# Altium schematic sheet A7_MGT - Ⅱ.SchDoc
size A3
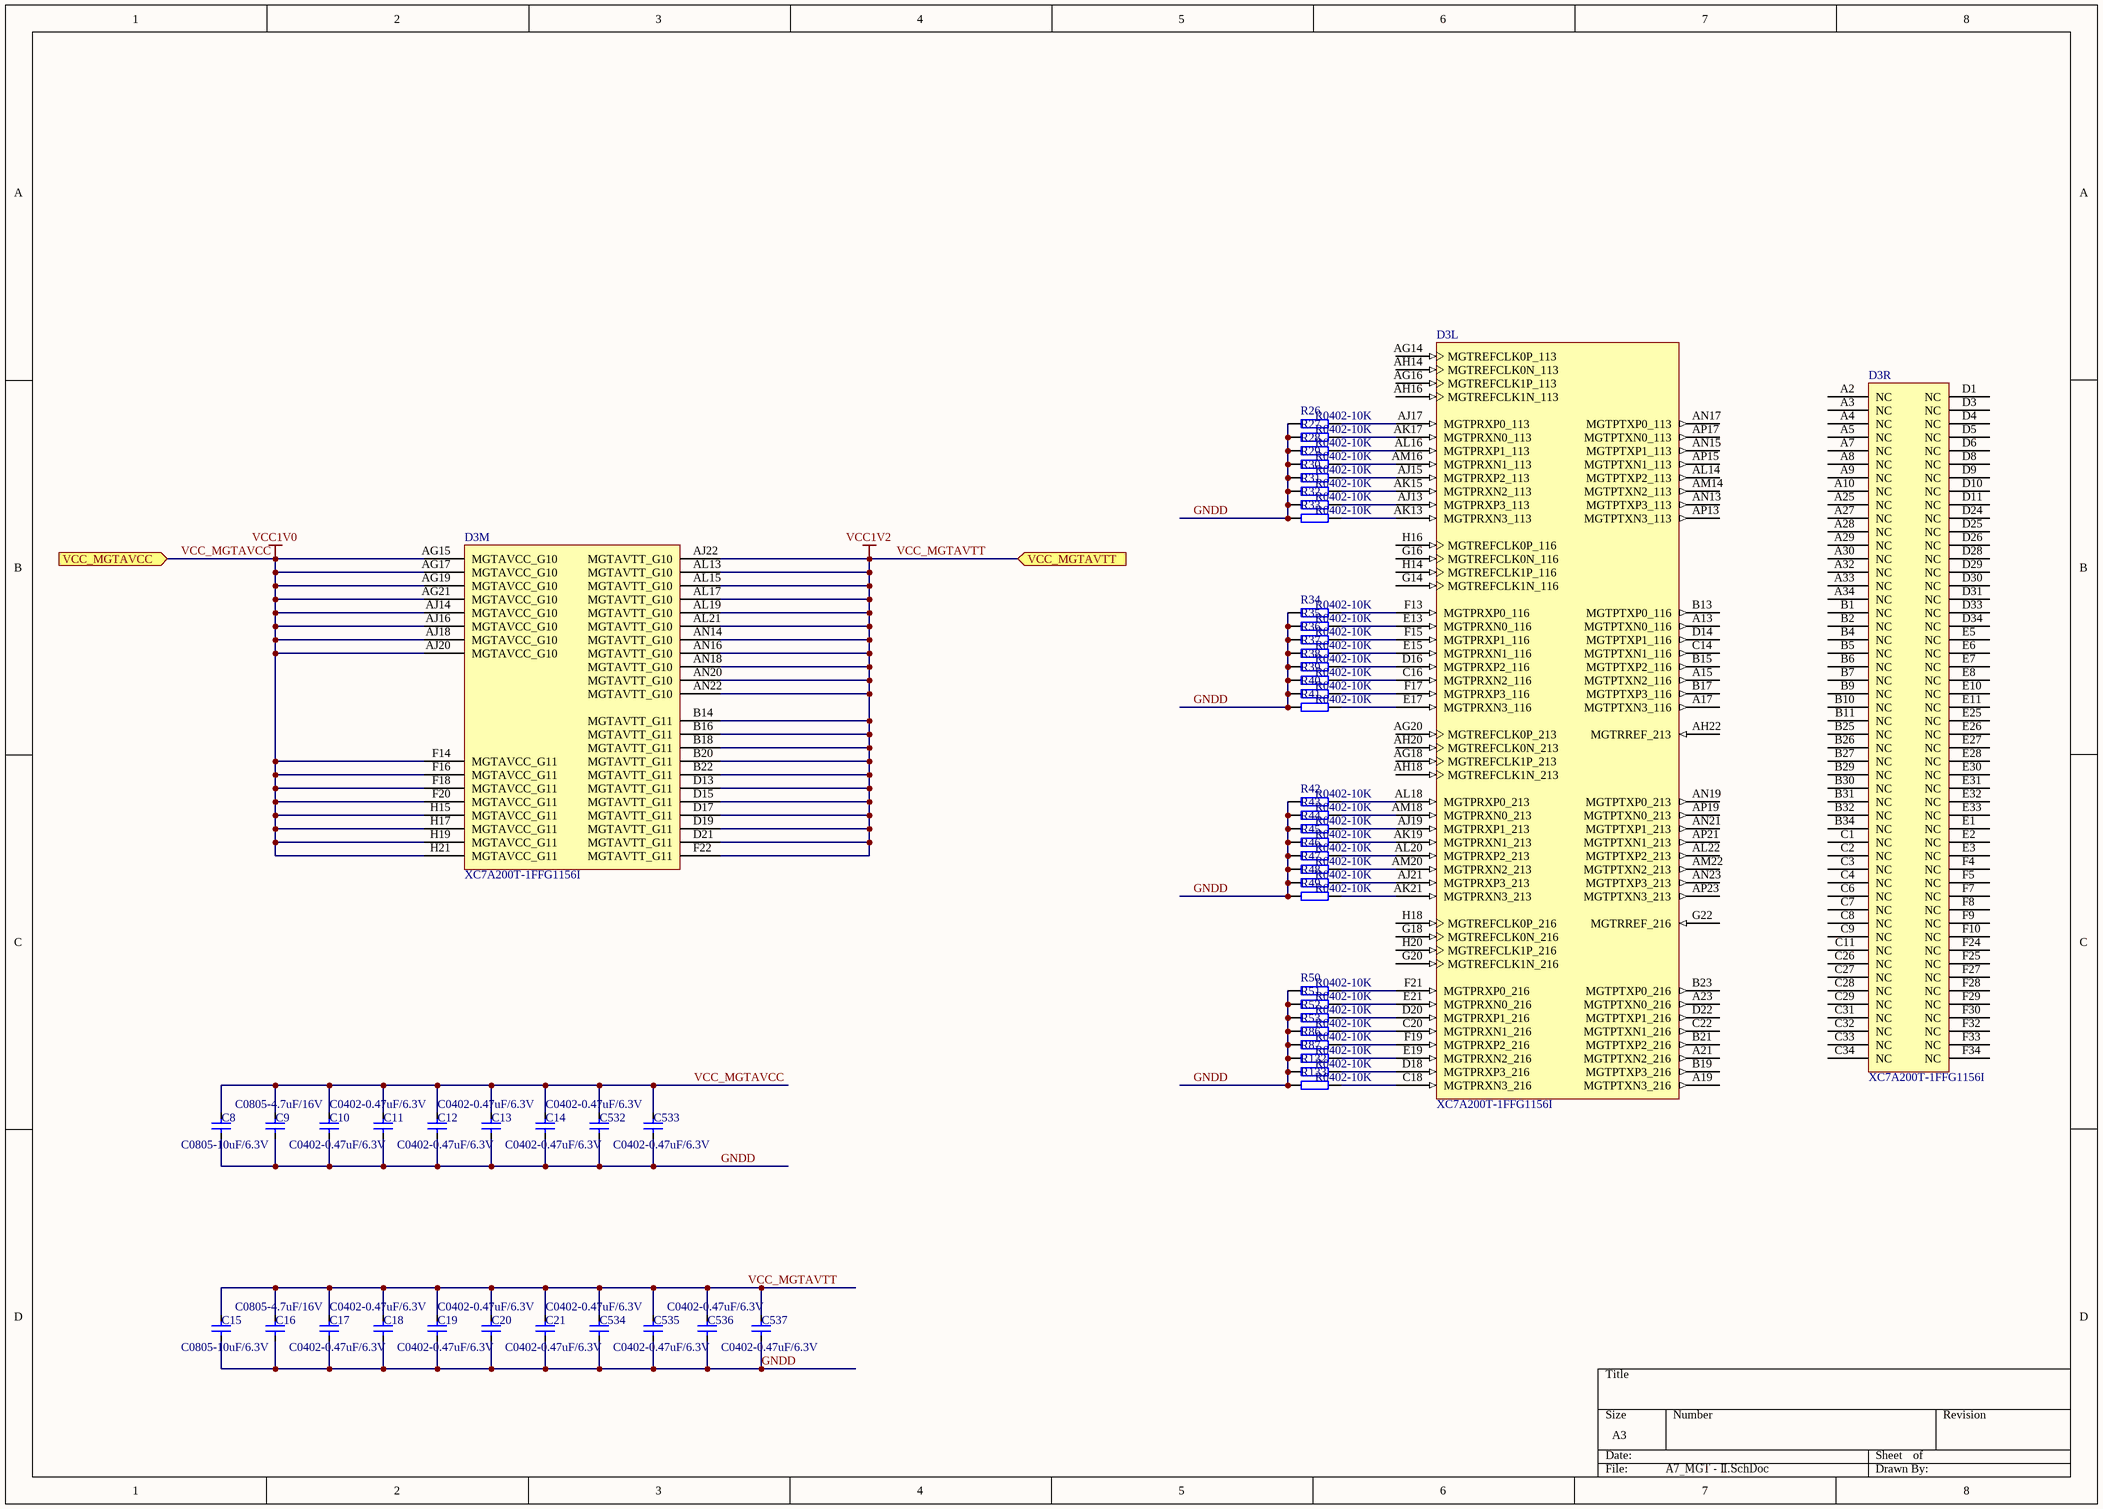
[diagram p0: A7_MGT - Ⅱ.SchDoc]

## Parts
C8  C0805-10uF/6.3V  [C0805]
C9  C0805-4.7uF/16V  [C0805]
C10  C0402-0.47uF/6.3V  [C0402]
C11  C0402-0.47uF/6.3V  [C0402]
C12  C0402-0.47uF/6.3V  [C0402]
C13  C0402-0.47uF/6.3V  [C0402]
C14  C0402-0.47uF/6.3V  [C0402]
C15  C0805-10uF/6.3V  [C0805]
C16  C0805-4.7uF/16V  [C0805]
C17  C0402-0.47uF/6.3V  [C0402]
C18  C0402-0.47uF/6.3V  [C0402]
C19  C0402-0.47uF/6.3V  [C0402]
C20  C0402-0.47uF/6.3V  [C0402]
C21  C0402-0.47uF/6.3V  [C0402]
C532  C0402-0.47uF/6.3V  [C0402]
C533  C0402-0.47uF/6.3V  [C0402]
C534  C0402-0.47uF/6.3V  [C0402]
C535  C0402-0.47uF/6.3V  [C0402]
C536  C0402-0.47uF/6.3V  [C0402]
C537  C0402-0.47uF/6.3V  [C0402]
D3  XC7A200T-1FFG1156I  [FFG1156]  (parts L,M,R of 18)
R26  R0402-10K  [R0402]
R27  R0402-10K  [R0402]
R28  R0402-10K  [R0402]
R29  R0402-10K  [R0402]
R30  R0402-10K  [R0402]
R31  R0402-10K  [R0402]
R32  R0402-10K  [R0402]
R33  R0402-10K  [R0402]
R34  R0402-10K  [R0402]
R35  R0402-10K  [R0402]
R36  R0402-10K  [R0402]
R37  R0402-10K  [R0402]
R38  R0402-10K  [R0402]
R39  R0402-10K  [R0402]
R40  R0402-10K  [R0402]
R41  R0402-10K  [R0402]
R42  R0402-10K  [R0402]
R43  R0402-10K  [R0402]
R44  R0402-10K  [R0402]
R45  R0402-10K  [R0402]
R46  R0402-10K  [R0402]
R47  R0402-10K  [R0402]
R48  R0402-10K  [R0402]
R49  R0402-10K  [R0402]
R50  R0402-10K  [R0402]
R51  R0402-10K  [R0402]
R52  R0402-10K  [R0402]
R53  R0402-10K  [R0402]
R86  R0402-10K  [R0402]
R87  R0402-10K  [R0402]
R132  R0402-10K  [R0402]
R133  R0402-10K  [R0402]

## Ports
VCC_MGTAVCC (in), VCC_MGTAVTT (in)

## Nets
VCC_MGTAVCC: C8.1 C9.1 C10.1 C11.1 C12.1 C13.1 C14.1 C532.1 C533.1 D3.AG15(MGTAVCC_G10) D3.AG17(MGTAVCC_G10) D3.AG19(MGTAVCC_G10) D3.AG21(MGTAVCC_G10) D3.AJ14(MGTAVCC_G10) D3.AJ16(MGTAVCC_G10) D3.AJ18(MGTAVCC_G10) D3.AJ20(MGTAVCC_G10) D3.F14(MGTAVCC_G11) D3.F16(MGTAVCC_G11) D3.F18(MGTAVCC_G11) D3.F20(MGTAVCC_G11) D3.H15(MGTAVCC_G11) D3.H17(MGTAVCC_G11) D3.H19(MGTAVCC_G11) D3.H21(MGTAVCC_G11) ; port VCC_MGTAVCC  [also labelled VCC1V0]
VCC_MGTAVTT: C15.1 C16.1 C17.1 C18.1 C19.1 C20.1 C21.1 C534.1 C535.1 C536.1 C537.1 D3.AJ22(MGTAVTT_G10) D3.AL13(MGTAVTT_G10) D3.AL15(MGTAVTT_G10) D3.AL17(MGTAVTT_G10) D3.AL19(MGTAVTT_G10) D3.AL21(MGTAVTT_G10) D3.AN14(MGTAVTT_G10) D3.AN16(MGTAVTT_G10) D3.AN18(MGTAVTT_G10) D3.AN20(MGTAVTT_G10) D3.AN22(MGTAVTT_G10) D3.B14(MGTAVTT_G11) D3.B16(MGTAVTT_G11) D3.B18(MGTAVTT_G11) D3.B20(MGTAVTT_G11) D3.B22(MGTAVTT_G11) D3.D13(MGTAVTT_G11) D3.D15(MGTAVTT_G11) D3.D17(MGTAVTT_G11) D3.D19(MGTAVTT_G11) D3.D21(MGTAVTT_G11) D3.F22(MGTAVTT_G11) ; port VCC_MGTAVTT  [also labelled VCC1V2]
GNDD: C8.2 C9.2 C10.2 C11.2 C12.2 C13.2 C14.2 C15.2 C16.2 C17.2 C18.2 C19.2 C20.2 C21.2 C532.2 C533.2 C534.2 C535.2 C536.2 C537.2 R26.1 R27.1 R28.1 R29.1 R30.1 R31.1 R32.1 R33.1 R34.1 R35.1 R36.1 R37.1 R38.1 R39.1 R40.1 R41.1 R42.1 R43.1 R44.1 R45.1 R46.1 R47.1 R48.1 R49.1 R50.1 R51.1 R52.1 R53.1 R86.1 R87.1 R132.1 R133.1
NetD3_AJ13: D3.AJ13(MGTPRXP3_113) R32.2
NetD3_AJ15: D3.AJ15(MGTPRXP2_113) R30.2
NetD3_AJ17: D3.AJ17(MGTPRXP0_113) R26.2
NetD3_AJ19: D3.AJ19(MGTPRXP1_213) R44.2
NetD3_AJ21: D3.AJ21(MGTPRXP3_213) R48.2
NetD3_AK13: D3.AK13(MGTPRXN3_113) R33.2
NetD3_AK15: D3.AK15(MGTPRXN2_113) R31.2
NetD3_AK17: D3.AK17(MGTPRXN0_113) R27.2
NetD3_AK19: D3.AK19(MGTPRXN1_213) R45.2
NetD3_AK21: D3.AK21(MGTPRXN3_213) R49.2
NetD3_AL16: D3.AL16(MGTPRXP1_113) R28.2
NetD3_AL18: D3.AL18(MGTPRXP0_213) R42.2
NetD3_AL20: D3.AL20(MGTPRXP2_213) R46.2
NetD3_AM16: D3.AM16(MGTPRXN1_113) R29.2
NetD3_AM18: D3.AM18(MGTPRXN0_213) R43.2
NetD3_AM20: D3.AM20(MGTPRXN2_213) R47.2
NetD3_C16: D3.C16(MGTPRXN2_116) R39.2
NetD3_C18: D3.C18(MGTPRXN3_216) R133.2
NetD3_C20: D3.C20(MGTPRXN1_216) R53.2
NetD3_D16: D3.D16(MGTPRXP2_116) R38.2
NetD3_D18: D3.D18(MGTPRXP3_216) R132.2
NetD3_D20: D3.D20(MGTPRXP1_216) R52.2
NetD3_E13: D3.E13(MGTPRXN0_116) R35.2
NetD3_E15: D3.E15(MGTPRXN1_116) R37.2
NetD3_E17: D3.E17(MGTPRXN3_116) R41.2
NetD3_E19: D3.E19(MGTPRXN2_216) R87.2
NetD3_E21: D3.E21(MGTPRXN0_216) R51.2
NetD3_F13: D3.F13(MGTPRXP0_116) R34.2
NetD3_F15: D3.F15(MGTPRXP1_116) R36.2
NetD3_F17: D3.F17(MGTPRXP3_116) R40.2
NetD3_F19: D3.F19(MGTPRXP2_216) R86.2
NetD3_F21: D3.F21(MGTPRXP0_216) R50.2

Not connected (* = marked no-connect by the designer): D3 A2(NC) A3(NC) A4(NC) A5(NC) A7(NC) A8(NC) A9(NC) A10(NC) A13(MGTPTXN0_116) A15(MGTPTXN2_116) A17(MGTPTXN3_116) A19(MGTPTXN3_216) A21(MGTPTXN2_216) A23(MGTPTXN0_216) A25(NC) A27(NC) A28(NC) A29(NC) A30(NC) A32(NC) A33(NC) A34(NC) AG14(MGTREFCLK0P_113) AG16(MGTREFCLK1P_113) AG18(MGTREFCLK1P_213) AG20(MGTREFCLK0P_213) AH14(MGTREFCLK0N_113) AH16(MGTREFCLK1N_113) AH18(MGTREFCLK1N_213) AH20(MGTREFCLK0N_213) AH22(MGTRREF_213) AL14(MGTPTXP2_113) AL22(MGTPTXP2_213) AM14(MGTPTXN2_113) AM22(MGTPTXN2_213) AN13(MGTPTXP3_113) AN15(MGTPTXP1_113) AN17(MGTPTXP0_113) AN19(MGTPTXP0_213) AN21(MGTPTXP1_213) AN23(MGTPTXP3_213) AP13(MGTPTXN3_113) AP15(MGTPTXN1_113) AP17(MGTPTXN0_113) AP19(MGTPTXN0_213) AP21(MGTPTXN1_213) AP23(MGTPTXN3_213) B1(NC) B2(NC) B4(NC) B5(NC) B6(NC) B7(NC) B9(NC) B10(NC) B11(NC) B13(MGTPTXP0_116) B15(MGTPTXP2_116) B17(MGTPTXP3_116) B19(MGTPTXP3_216) B21(MGTPTXP2_216) B23(MGTPTXP0_216) B25(NC) B26(NC) B27(NC) B29(NC) B30(NC) B31(NC) B32(NC) B34(NC) C1(NC) C2(NC) C3(NC) C4(NC) C6(NC) C7(NC) C8(NC) C9(NC) C11(NC) C14(MGTPTXN1_116) C22(MGTPTXN1_216) C26(NC) C27(NC) C28(NC) C29(NC) C31(NC) C32(NC) C33(NC) C34(NC) D1(NC) D3(NC) D4(NC) D5(NC) D6(NC) D8(NC) D9(NC) D10(NC) D11(NC) D14(MGTPTXP1_116) D22(MGTPTXP1_216) D24(NC) D25(NC) D26(NC) D28(NC) D29(NC) D30(NC) D31(NC) D33(NC) D34(NC) E1(NC) E2(NC) E3(NC) E5(NC) E6(NC) E7(NC) E8(NC) E10(NC) E11(NC) E25(NC) E26(NC) E27(NC) E28(NC) E30(NC) E31(NC) E32(NC) E33(NC) F4(NC) F5(NC) F7(NC) F8(NC) F9(NC) F10(NC) F24(NC) F25(NC) F27(NC) F28(NC) F29(NC) F30(NC) F32(NC) F33(NC) F34(NC) G14(MGTREFCLK1N_116) G16(MGTREFCLK0N_116) G18(MGTREFCLK0N_216) G20(MGTREFCLK1N_216) G22(MGTRREF_216) H14(MGTREFCLK1P_116) H16(MGTREFCLK0P_116) H18(MGTREFCLK0P_216) H20(MGTREFCLK1P_216)

## Library data of the parts
C8 C15 = C1210-22uF/16V: Part_number: C0805-10uF/6.3V; Part_type: CAP; Value: C0805-10uF/6.3V; Schematic_Part: CAP; PCB_Footprint: C0805
C9 C16 = C0805-4.7uF/50V: X7R; Manufacturer: SAMSUNG; Part_number: C0805-4.7uF/16V; Part_type: CAP; Value: C0805-4.7uF/16V; Schematic_Part: CAP; PCB_Footprint: C0805; datasheet: #DataSheet\C_Samsung_General Capacitors.pdf#
C10-C14 C17-C21 C532-C537 = C0402-0.1uF/16V: X7R; Manufacturer: SAMSUNG; Manufacturer_p/n: CL05X7R104KO5NNN; Part_number: C0402-0.47uF/6.3V; Part_type: CAP; Value: C0402-0.47uF/6.3V; temperature: -55℃\+125℃; Schematic_Part: CAP; PCB_Footprint: C0402; datasheet: #DataSheet\C_Samsung_General Capacitors.pdf#
D3 = XC7A200T-1FFG1156I: Artix-7 FPGA, 500 User I/Os, 16 GTP, 1156-Ball BGA, Speed Grade 1, Industrial Grade, Pb-Free; Manufacturer: Xilinx; Block RAM Blocks (18Kb): 730; Block RAM Blocks (36Kb): 365; Block RAM Blocks (Max Kb): 13140; CLBs (Slices): 33650; Clock Mgmt Tiles (CMTs): 10; DSP48E1 Slices: 740; Logic Cells: 215360; Max User I/O: 500; Speed Grade: -1; DatasheetVersion: v1.12; PackageVersion: Rev 1.8; PackageReference: FFG1156; PackageDescription: Flip-Chip BGA, Body 35 x 35 mm, 1.0 mm Pitch; CLBs (Max Distributed RAM Kb): 2888; Generic Part Number: XC7A200T; RoHS: Pb-Free; Mounting Technology: Surface Mount; Code_JEDEC: MS-034-AAR-1; PartNumber: XC7A200T-1FFG1156I; ComponentLink1Description: Datasheet; ComponentLink1URL: http://www.xilinx.com/support/documentation/data_sheets/ds180_7Series_Overview.pdf; ComponentLink2Description: Package Specification; ComponentLink2URL: http://www.xilinx.com/support/documentation/user_guides/ug475_7Series_Pkg_Pinout.pdf; ComponentLink3Description: DC and Switching Characteristics; ComponentLink3URL: http://www.xilinx.com/support/documentation/data_sheets/ds181_Artix_7_Data_Sheet.pdf; ComponentLink4Description: Package File; ComponentLink4URL: http://www.xilinx.com/support/packagefiles/a7packages/xc7a200tfbg676pkg.txt; ComponentLink5Description: Packaging and Pinout; ComponentLink5URL: http://www.xilinx.com/support/documentation/user_guides/ug475_7Series_Pkg_Pinout.pdf
R26-R53 R86 R87 R132 R133 = R0402-10K: Manufacturer: SAMSUNG; Part_number: R0402-10K; Part_type: RES; Value: R0402-10K; Schematic_Part: RES; PCB_Footprint: R0402